# EAGLE schematic WIBL (EAGLE 9.6.2)

## Sheet 1 of 2: Main Logic/Microcontroller/Storage
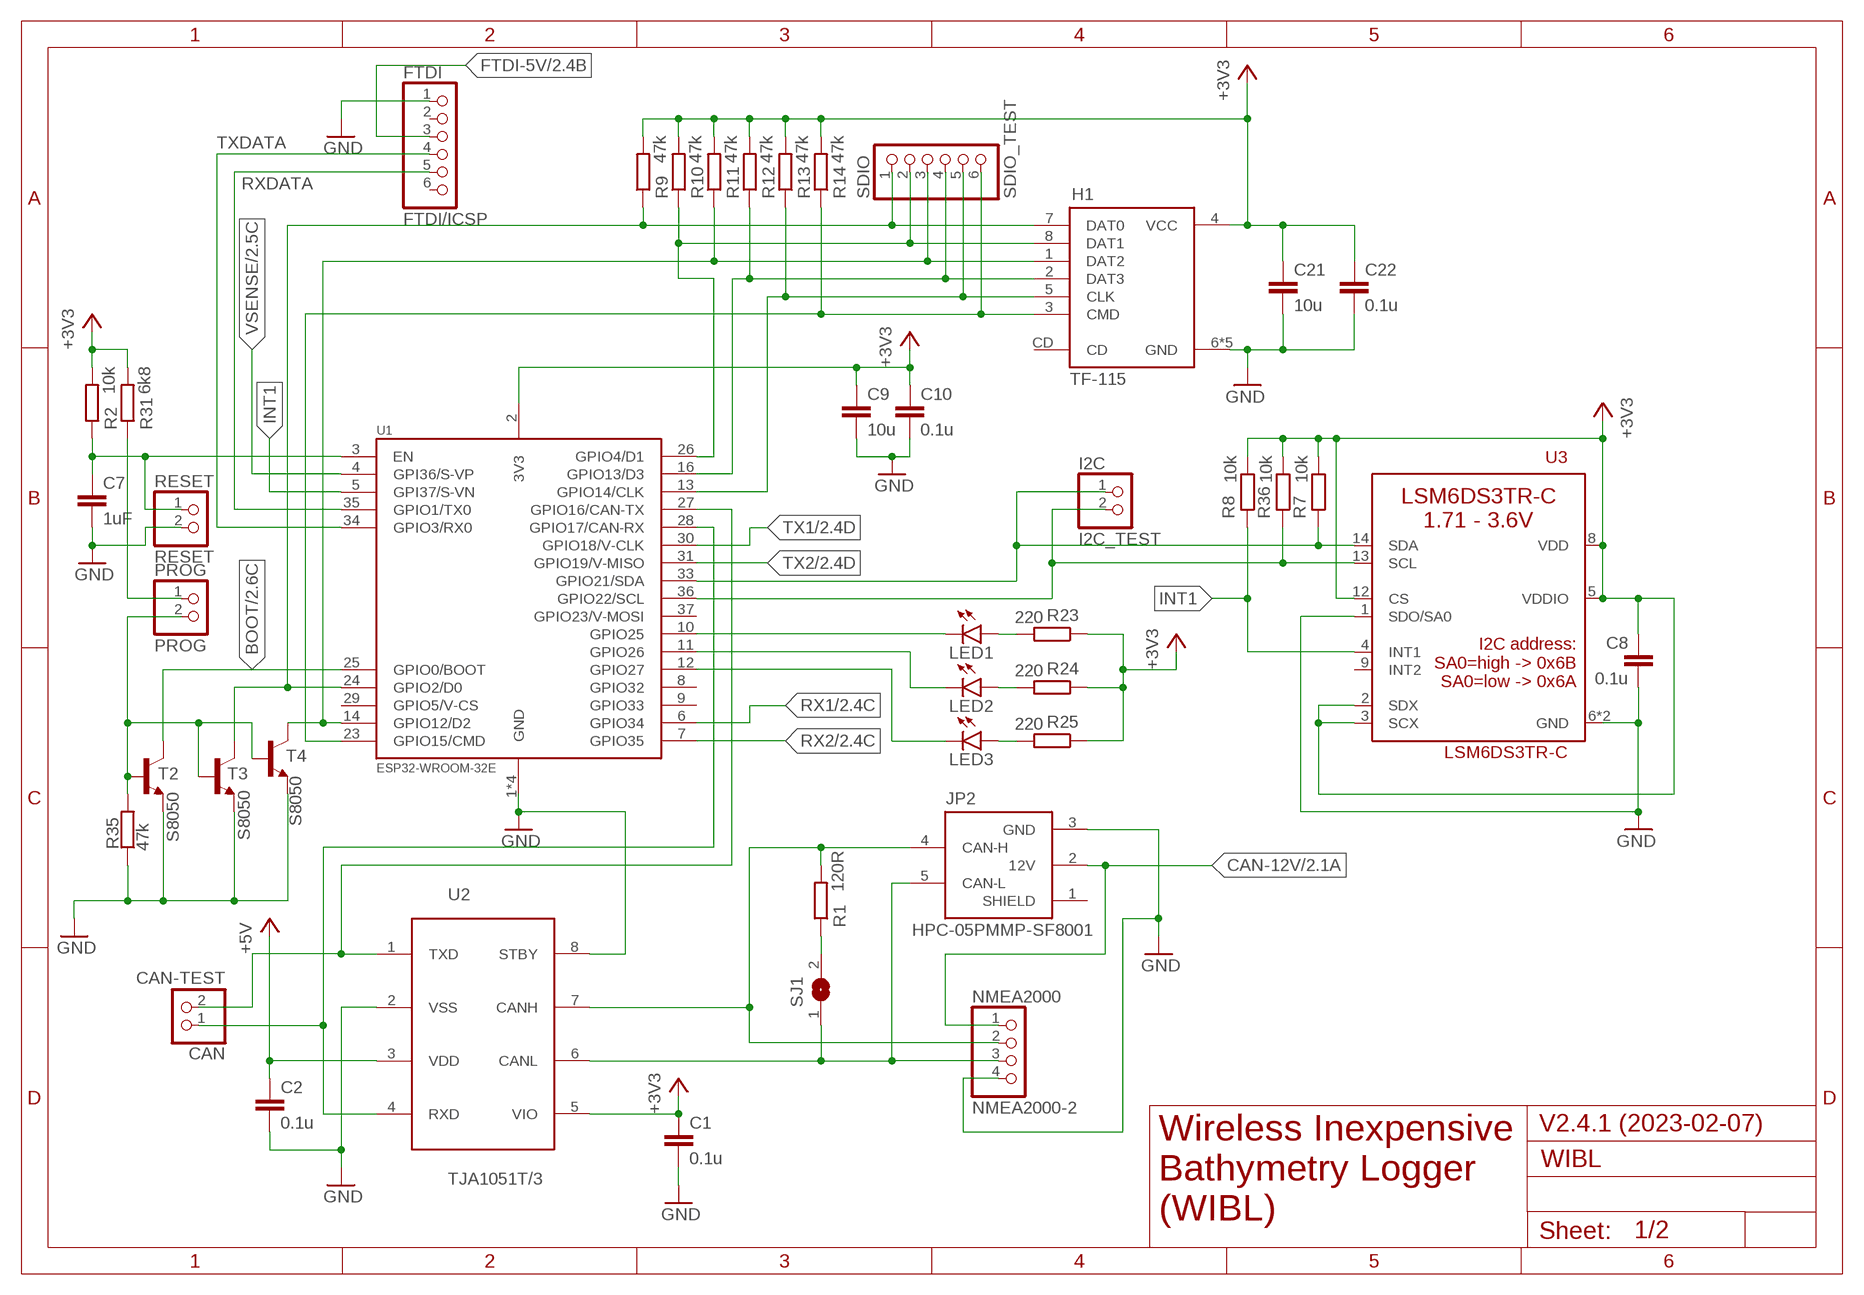
[diagram p0: schematic, sheet 1]

### Parts
C1  0.1u  C-EUC0805  [C0805]
C2  0.1u  C-EUC0805  [C0805]
C7  1uF  C-EUC0805  [C0805]
C8  0.1u  C-EUC0805  [C0805]
C9  10u  C-EUC0805  [C0805]
C10  0.1u  C-EUC0805  [C0805]
C21  10u  C-EUC0805  [C0805]
C22  0.1u  C-EUC0805  [C0805]
CAN  CAN-TEST  PINHD-1X2  [1X02]
FTDI  FTDI/ICSP  PINHD-1X6  [1X06]
H1  TF-115  XUNPU-MICROSD-SOCKET  [XUNPU-MICROSD-SOCKET]
I2C  I2C_TEST  PINHD-1X2  [1X02]
JP2  HPC-05PMMP-SF8001  NMEA2000  [NMEA2000]
LED1  LEDCHIP-LED0603  [CHIP-LED0603]
LED2  LEDCHIP-LED0603  [CHIP-LED0603]
LED3  LEDCHIP-LED0603  [CHIP-LED0603]
NMEA2000  NMEA2000-2  PINHD-1X4  [1X04]
PROG  PROG  PINHD-1X2  [1X02]
R1  120R  R-EU_R0805  [R0805]
R2  10k  R-EU_R0805  [R0805]
R7  10k  R-EU_R0805  [R0805]
R8  10k  R-EU_R0805  [R0805]
R9  47k  R-EU_R0805  [R0805]
R10  47k  R-EU_R0805  [R0805]
R11  47k  R-EU_R0805  [R0805]
R12  47k  R-EU_R0805  [R0805]
R13  47k  R-EU_R0805  [R0805]
R14  47k  R-EU_R0805  [R0805]
R23  220  R-EU_R0805  [R0805]
R24  220  R-EU_R0805  [R0805]
R25  220  R-EU_R0805  [R0805]
R31  6k8  R-EU_R0805  [R0805]
R35  47k  R-EU_R0805  [R0805]
R36  10k  R-EU_R0805  [R0805]
RESET  RESET  PINHD-1X2  [1X02]
SDIO  SDIO_TEST  PINHD-1X6  [1X06]
SJ1  SJ  [SJ]
T2  S8050  BC846  [SOT23]
T3  S8050  BC846  [SOT23]
T4  S8050  BC846  [SOT23]
U1  ESP32-WROOM-32E  [ESPS32-WROOM-32E]
U2  TJA1051T/3  MCP2562T-E/SN  [SOIC8]
U3  LSM6DS3TR-C  [LGA-14-2.5X3MM]

### Nets
+3V3: C1.1 C8.1 C9.1 C10.1 C21.1 C22.1 H1.4(VCC) R2.2 R7.2 R8.2 R9.2 R10.2 R11.2 R12.2 R13.2 R14.2 R23.1 R24.1 R25.1 R31.2 R36.2 U1.2(3V3) U2.5(VIO) U3.2(SDX) U3.3(SCX) U3.5(VDDIO) U3.8(VDD) U3.12(CS) ; also sheet 2
+5V: C2.1 U2.3(VDD) ; also sheet 2
BOOT: T2.3(C) U1.25(GPIO0/BOOT) ; also sheet 2
CAN-12V: JP2.2(12V) NMEA2000.1 ; also sheet 2
FTDI-5V: FTDI.3 ; also sheet 2
GND: C1.2 C2.2 C7.2 C8.2 C9.2 C10.2 C21.2 C22.2 FTDI.1 H1.6(GND) H1.GND1(GND) H1.GND2(GND) H1.GND3(GND) H1.GND4(GND) JP2.3(GND) NMEA2000.4 R35.1 RESET.2 T2.2(E) T3.2(E) T4.2(E) U1.1(GND) U1.15(GND) U1.38(GND) U1.THERM(GND) U2.2(VSS) U2.8(STBY) U3.1(SDO/SA0) U3.6(GND) U3.7(GND) ; also sheet 2
INT1: R8.1 U1.5(GPI37/S-VN) U3.4(INT1)
N$1: JP2.4(CAN-H) NMEA2000.2 R1.2 U2.7(CANH)
N$2: JP2.5(CAN-L) NMEA2000.3 SJ1.1 U2.6(CANL)
N$3: R1.1 SJ1.2
N$4: C7.1 R2.1 RESET.1 U1.3(EN)
N$6: CAN.2 U1.27(GPIO16/CAN-TX) U2.1(TXD)
N$7: CAN.1 U1.28(GPIO17/CAN-RX) U2.4(RXD)
N$10: H1.1(DAT2) R11.1 SDIO.3 T4.3(C) U1.14(GPIO12/D2)
N$11: H1.8(DAT1) R10.1 SDIO.2 U1.26(GPIO4/D1)
N$22: H1.7(DAT0) R9.1 SDIO.1 T3.3(C) U1.24(GPIO2/D0)
N$24: H1.2(DAT3) R12.1 SDIO.4 U1.16(GPIO13/D3)
N$25: H1.5(CLK) R13.1 SDIO.5 U1.13(GPIO14/CLK)
N$26: H1.3(CMD) R14.1 SDIO.6 U1.23(GPIO15/CMD)
N$35: LED1.C U1.10(GPIO25)
N$36: LED2.C U1.11(GPIO26)
N$37: PROG.2 R35.2 T2.1(B) T3.1(B) T4.1(B)
N$38: LED3.C U1.12(GPIO27)
N$39: LED1.A R23.2
N$40: LED2.A R24.2
N$43: PROG.1 R31.1
N$44: LED3.A R25.2
RX1: U1.6(GPIO34) ; also sheet 2
RX2: U1.7(GPIO35) ; also sheet 2
RXDATA: FTDI.5 U1.35(GPIO1/TX0)
SCL: I2C.1 R7.1 U1.33(GPIO21/SDA) U3.14(SDA)
SDA: I2C.2 R36.1 U1.36(GPIO22/SCL) U3.13(SCL)
TX1: U1.30(GPIO18/V-CLK) ; also sheet 2
TX2: U1.31(GPIO19/V-MISO) ; also sheet 2
TXDATA: FTDI.4 U1.34(GPIO3/RX0)
VSENSE: U1.4(GPI36/S-VP) ; also sheet 2
Unconnected: FTDI.2 FTDI.6 H1.CD JP2.1(SHIELD) U1.8(GPIO32) U1.9(GPIO33) U1.29(GPIO5/V-CS) U1.37(GPIO23/V-MOSI) U3.9(INT2)

### Notes on the sheet
- V2.4.1 (2023-02-07)
- Wireless Inexpensive
  Bathymetry Logger
  (WIBL)

## Sheet 2 of 2: NMEA0183 Transceiver/Power Section
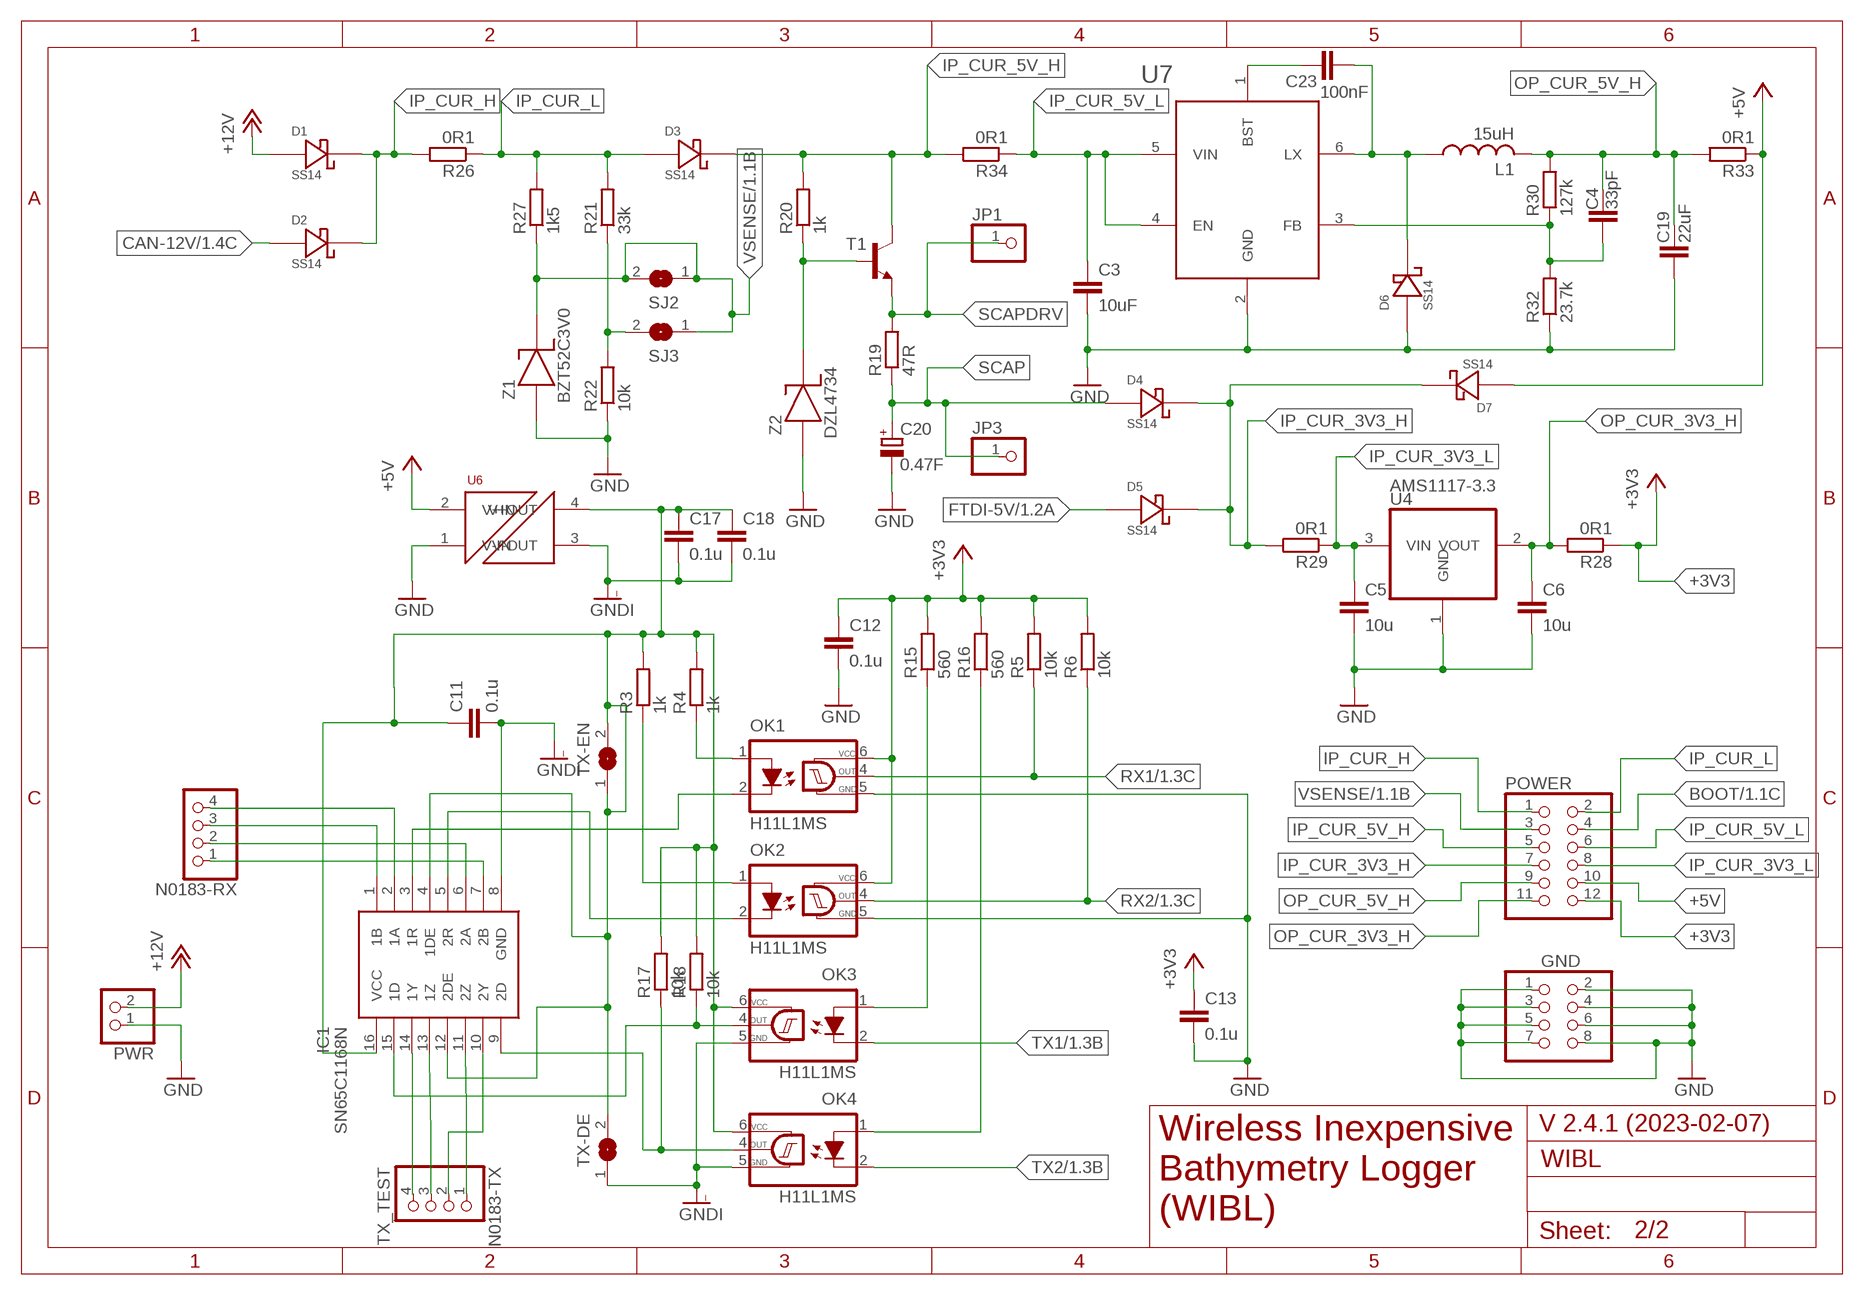
[diagram p1: schematic, sheet 2]

### Parts
C3  10uF  C-EUC1206  [C1206]
C4  33pF  C-EUC0603  [C0603]
C5  10u  C-EUC0805  [C0805]
C6  10u  C-EUC0805  [C0805]
C11  0.1u  C-EUC0805  [C0805]
C12  0.1u  C-EUC0805  [C0805]
C13  0.1u  C-EUC0805  [C0805]
C17  0.1u  C-EUC0805  [C0805]
C18  0.1u  C-EUC0805  [C0805]
C19  22uF  C-EUC0603  [C0603]
C20  0.47F  CPOL-EUP128-50  [P128-50]
C23  100nF  C0402  [C0402]
D1  SS14  [DO-214AC]
D2  SS14  [DO-214AC]
D3  SS14  [DO-214AC]
D4  SS14  [DO-214AC]
D5  SS14  [DO-214AC]
D6  SS14  [DO-214AC]
D7  SS14  [DO-214AC]
GND  PINHD-2X4  [2X04]
IC1  SN65C1168N  [DIP794W53P254L1930H508Q16N]
JP1  PINHD-1X1  [1X01]
JP3  PINHD-1X1  [1X01]
L1  15uH  MWSA0603S  [MWSA0603S]
N0183-RX  PINHD-1X4  [1X04]
N0183-TX  TX_TEST  PINHD-1X4  [1X04]
OK1  H11L1MS  [DIL6-SMD]
OK2  H11L1MS  [DIL6-SMD]
OK3  H11L1MS  [DIL6-SMD]
OK4  H11L1MS  [DIL6-SMD]
POWER  PINHD-2X6  [2X06]
PWR  PINHD-1X2  [1X02]
R3  1k  R-EU_R0805  [R0805]
R4  1k  R-EU_R0805  [R0805]
R5  10k  R-EU_R0805  [R0805]
R6  10k  R-EU_R0805  [R0805]
R15  560  R-EU_R0805  [R0805]
R16  560  R-EU_R0805  [R0805]
R17  10k  R-EU_R0805  [R0805]
R18  10k  R-EU_R0805  [R0805]
R19  47R  R-EU_R0805  [R0805]
R20  1k  R-EU_R0805  [R0805]
R21  33k  R-EU_R0805  [R0805]
R22  10k  R-EU_R0805  [R0805]
R26  0R1  R-EU_R0603  [R0603]
R27  1k5  R-EU_R0805  [R0805]
R28  0R1  R-EU_R0603  [R0603]
R29  0R1  R-EU_R0603  [R0603]
R30  127k  R-EU_R0603  [R0603]
R32  23.7k  R-EU_R0603  [R0603]
R33  0R1  R-EU_R0603  [R0603]
R34  0R1  R-EU_R0603  [R0603]
SJ2  SJ  [SJ]
SJ3  SJ  [SJ]
T1  BC817-16-NPN-SOT23-BEC  [SOT23-BEC]
TX-DE  SJ  [SJ]
TX-EN  SJ  [SJ]
U4  AMS1117-3.3  REG1117  [SOT223]
U6  RFM-0505S  [RFM-0505S]
U7  BL9352A  [SOT-23-6L]
Z1  BZT52C3V0  [SOD123]
Z2  DZL4734  [SOD-123FL]

### Nets
+3V3: C12.1 C13.1 OK1.6(VCC) OK2.6(VCC) POWER.12 R5.2 R6.2 R15.2 R16.2 R28.1 ; also sheet 1
+5V: D7.A POWER.10 R33.1 U6.2(V+IN) ; also sheet 1
+12V: D1.A PWR.2
BOOT: POWER.4 ; also sheet 1
CAN-12V: D2.A ; also sheet 1
FTDI-5V: D5.A ; also sheet 1
GND: C3.2 C5.2 C6.2 C12.2 C13.2 C19.1 C20.- D6.A GND.1 GND.2 GND.3 GND.4 GND.5 GND.6 GND.7 GND.8 OK1.5(GND) OK2.5(GND) PWR.1 R22.1 R32.1 U4.1(GND) U6.1(V-IN) U7.2(GND) Z1.1(A) Z2.A ; also sheet 1
GNDI: C11.2 C17.2 C18.2 IC1.8(GND) OK3.5(GND) OK4.5(GND) TX-DE.1 U6.3(V-OUT)
IP_CUR_3V3_H: D4.K D5.K D7.K POWER.7 R29.2
IP_CUR_3V3_L: C5.1 POWER.8 R29.1 U4.3(VIN)
IP_CUR_5V_H: D3.K POWER.5 R20.2 R34.2 T1.C
IP_CUR_5V_L: C3.1 POWER.6 R34.1 U7.4(EN) U7.5(VIN)
IP_CUR_H: D1.K D2.K POWER.1 R26.2
IP_CUR_L: D3.A POWER.2 R21.2 R26.1 R27.2
N$5: IC1.2(1A) N0183-RX.4
N$8: IC1.14(1Y) N0183-TX.4
N$9: IC1.1(1B) N0183-RX.3
N$12: IC1.6(2A) N0183-RX.2
N$13: IC1.3(1R) OK1.2(C)
N$14: IC1.5(2R) OK2.2(C)
N$15: OK1.1(A) R4.1
N$16: OK2.1(A) R3.1
N$17: IC1.7(2B) N0183-RX.1
N$18: IC1.13(1Z) N0183-TX.3
N$19: IC1.10(2Y) N0183-TX.2
N$20: IC1.11(2Z) N0183-TX.1
N$21: C11.1 C17.1 C18.1 IC1.4(1DE) IC1.12(2DE) IC1.16(VCC) OK3.6(VCC) OK4.6(VCC) R3.2 R4.2 R17.2 R18.2 TX-DE.2 TX-EN.1 TX-EN.2 U6.4(V+OUT)
N$31: OK3.1(A) R15.1
N$32: OK4.1(A) R16.1
N$33: IC1.15(1D) OK3.4(OUT) R18.1
N$34: IC1.9(2D) OK4.4(OUT) R17.1
N$41: R20.1 T1.B Z2.K
N$42: C23.P$1 U7.1(BST)
N$45: C23.P$2 D6.K L1.P$1 U7.6(LX)
N$46: R21.1 R22.2 SJ3.2
N$48: C4.1 R30.1 R32.2 U7.3(FB)
OP_CUR_3V3_H: C6.1 POWER.11 R28.2 U4.2(VOUT)
OP_CUR_5V_H: C4.2 C19.2 L1.P$2 POWER.9 R30.2 R33.2
RX1: OK1.4(OUT) R5.1 ; also sheet 1
RX2: OK2.4(OUT) R6.1 ; also sheet 1
SCAP: C20.+ D4.A JP3.1 R19.1
SCAPDRV: JP1.1 R19.2 T1.E
TX1: OK3.2(C) ; also sheet 1
TX2: OK4.2(C) ; also sheet 1
VSENSE: POWER.3 R27.1 SJ2.1 SJ2.2 SJ3.1 Z1.2(K) ; also sheet 1

### Notes on the sheet
- V 2.4.1 (2023-02-07)
- Wireless Inexpensive
  Bathymetry Logger
  (WIBL)

## Library data of the parts
C1-C13 C17-C19 C21 C22 = rcl:C-EU: CAPACITOR, European symbol; SPICEPREFIX: C
C20 = rcl:CPOL-EU: POLARIZED CAPACITOR, European symbol; SPICEPREFIX: C
C23 = sb2030_logger:C0402
CAN I2C PROG PWR RESET = pinhead:PINHD-1X2: PIN HEADER
D1-D7 = sb2030_logger:SS14
FTDI SDIO = pinhead:PINHD-1X6: PIN HEADER
GND = pinhead:PINHD-2X4: PIN HEADER
H1 = sb2030_logger:XUNPU-MICROSD-SOCKET: Micro-SD push-push card holder; LCSC C266620, Manufacturer TF-115 (XunPu)
IC1 = SN65C1168N:SN65C1168N: Dual Differential Drivers And Receivers Source: Datasheet <https://www.ti.com/lit/ds/symlink/sn65c1168.pdf>; DESCRIPTION: Dual Differential Drivers And Receivers; HEIGHT: 5.08mm; MANUFACTURER_NAME: Texas Instruments; MANUFACTURER_PART_NUMBER: SN65C1168N; MOUSER_PART_NUMBER: 595-SN65C1168N; MOUSER_PRICE-STOCK: https://www.mouser.co.uk/ProductDetail/Texas-Instruments/SN65C1168N?qs=6siQ5y5nVCynC3%2F3CVM95w%3D%3D
JP1 JP3 = pinhead:PINHD-1X1: PIN HEADER
JP2 = sb2030_logger:NMEA2000
L1 = sb2030_logger:MWSA0603S
LED1-LED3 = led:LED: LED OSRAM: - CHIPLED LG R971, LG N971, LY N971, LG Q971, LY Q971, LO R971, LY R971 LH N974, LH R974 LS Q976, LO Q976, LY Q976 LO Q996 - Hyper CHIPLED LW Q18S LB Q993, LB Q99A, LB R99A - SideLED LS A670, LO A670, LY A670, LG A670, LP A670 LB A673, LV A673, LT A673, LW A673 LH A674 LY A675 LS A676, LA A676, LO A676, LY A676, LW A676 LS A679, LY A679, LG A679 - Hyper Micro SIDELED® LS Y876, LA Y876, LO Y876, LY Y876 LT Y87S - SmartLED LW L88C, LW L88S LB L89C, LB L89S, LG L890 LS L89K, LO L89K, LY L89K LS L896, LA L896, LO L896, LY L896 - TOPLED LS T670, LO T670, LY T670, LG T670, LP T670 LSG T670, LSP T670, LSY T670, LOP T670, LYG T670 LG T671, LOG T671, LSG T671 LB T673, LV T673, LT T673, LW T673 LH T674 LS T676, LA T676, LO T676, LY T676, LB T676, LH T676, LSB T676, LW T676 LB T67C, LV T67C, LT T67C, LS T67K, LO T67K, LY T67K, LW E67C LS E67B, LA E67B, LO E67B, LY E67B, LB E67C, LV E67C, LT E67C LW T67C LS T679, LY T679, LG T679 LS T770, LO T770, LY T770, LG T770, LP T770 LB T773, LV T773, LT T773, LW T773 LH T774 LS E675, LA E675, LY E675, LS T675 LS T776, LA T776, LO T776, LY T776, LB T776 LHGB T686 LT T68C, LB T68C - Hyper Mini TOPLED® LB M676 - Mini TOPLED Santana® LG M470 LS M47K, LO M47K, LY M47K Source: http://www.osram.convergy.de LUXEON: - LUMILED® LXK2-PW12-R00, LXK2-PW12-S00, LXK2-PW14-U00, LXK2-PW14-V00 LXK2-PM12-R00, LXK2-PM12-S00, LXK2-PM14-U00 LXK2-PE12-Q00, LXK2-PE12-R00, LXK2-PE12-S00, LXK2-PE14-T00, LXK2-PE14-U00 LXK2-PB12-K00, LXK2-PB12-L00, LXK2-PB12-M00, LXK2-PB14-N00, LXK2-PB14-P00, LXK2-PB14-Q00 LXK2-PR12-L00, LXK2-PR12-M00, LXK2-PR14-Q00, LXK2-PR14-R00 LXK2-PD12-Q00, LXK2-PD12-R00, LXK2-PD12-S00 LXK2-PH12-R00, LXK2-PH12-S00 LXK2-PL12-P00, LXK2-PL12-Q00, LXK2-PL12-R00 Source: www.luxeon.com KINGBRIGHT: KA-3528ASYC Source: www.kingbright.com
N0183-RX N0183-TX NMEA2000 = pinhead:PINHD-1X4: PIN HEADER
OK1-OK4 = optocoupler:H11L*M: 6-Pin DIP Optocoupler Source: http://www.fairchildsemi.com/ds/H1/H11L2-M.pdf; OC_FARNELL: unknown; OC_NEWARK: unknown
POWER = pinhead:PINHD-2X6: PIN HEADER
R1-R36 = rcl:R-EU_: RESISTOR, European symbol; SPICEPREFIX: R
SJ1-SJ3 TX-DE TX-EN = jumper:SJ: SMD solder JUMPER
T1 = transistor:*-NPN-: NPN Transistror BF959 corrected 2008.03.06
T2-T4 = transistor:BC846: NPN TRANSISTOR
U1 = sb2030_logger:ESP32-WROOM-32E
U2 = sb2030_logger:MCP2562T-E/SN: This is the SMD version of the MCP2562 CAN bus transceiver with Vio pin for digitial IO voltage selection
U3 = LSM6DS3TR-C:LSM6DS3TR-C: Check availability <https://pricing.snapeda.com/parts/LSM6DS3TR-C/STMicroelectronics/view-part?ref=eda>; AVAILABILITY: In Stock; DESCRIPTION: IMUs - Inertial Measurement Units iNEMO 6DoF inertial module, for entry level / mid-tier smart phones and Portable PC platforms; MF: STMicroelectronics; MP: LSM6DS3TR-C; PACKAGE: None; PRICE: None; PURCHASE-URL: https://pricing.snapeda.com/search/part/LSM6DS3TR-C/?ref=eda
U4 = burr-brown:REG1117: 800mA and 1A Low Dropout (LDO) Positive Regulator 1.8V, 2.5V, 2.85V, 3.3V, 5V, and Adj; MPN: REG1117; OC_FARNELL: 1097566; OC_NEWARK: 14P6981
U6 = sb2030_logger:RFM-0505S
U7 = sb2030_logger:BL9352A
Z1 = sb2030_logger:BZT52C3V0
Z2 = sb2030_logger:DZL4734